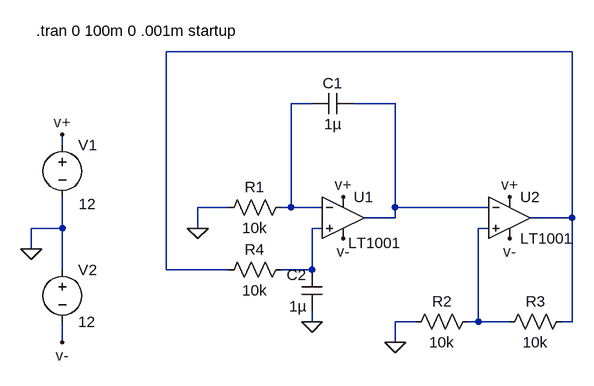
[diagram p0: schematic cuadrada_triangular3.asc]
cuadrada_triangular3.asc, the LTspice schematic file:
Version 4
SHEET 1 880 680
WIRE 528 -96 -96 -96
WIRE 128 -16 96 -16
WIRE 256 -16 192 -16
WIRE -256 48 -256 32
WIRE 0 144 -48 144
WIRE 96 144 96 -16
WIRE 96 144 80 144
WIRE 144 144 96 144
WIRE 256 144 256 -16
WIRE 400 144 256 144
WIRE 256 160 256 144
WIRE 256 160 208 160
WIRE 528 160 528 -96
WIRE 528 160 464 160
WIRE -256 176 -256 128
WIRE -256 176 -304 176
WIRE -48 176 -48 144
WIRE 144 176 128 176
WIRE 400 176 384 176
WIRE -304 208 -304 176
WIRE -256 240 -256 176
WIRE -96 240 -96 -96
WIRE 0 240 -96 240
WIRE 128 240 128 176
WIRE 128 240 80 240
WIRE 128 320 128 304
WIRE 288 320 256 320
WIRE 384 320 384 176
WIRE 384 320 368 320
WIRE 432 320 384 320
WIRE 528 320 528 160
WIRE 528 320 512 320
WIRE -256 352 -256 320
WIRE 256 352 256 320
FLAG -304 208 0
FLAG -256 32 v+
FLAG -256 352 v-
FLAG 256 352 0
FLAG -48 176 0
FLAG 128 320 0
FLAG 176 128 v+
FLAG 432 128 v+
FLAG 176 192 v-
FLAG 432 192 v-
SYMBOL Opamps\\LT1001 176 96 R0
WINDOW 3 8 103 Left 2
SYMATTR InstName U1
SYMBOL Opamps\\LT1001 432 96 R0
SYMATTR InstName U2
SYMBOL res 96 128 R90
WINDOW 0 0 56 VBottom 2
WINDOW 3 32 56 VTop 2
SYMATTR InstName R1
SYMATTR Value 10k
SYMBOL res 384 304 R90
WINDOW 0 0 56 VBottom 2
WINDOW 3 32 56 VTop 2
SYMATTR InstName R2
SYMATTR Value 10k
SYMBOL res 528 304 R90
WINDOW 0 0 56 VBottom 2
WINDOW 3 32 56 VTop 2
SYMATTR InstName R3
SYMATTR Value 10k
SYMBOL cap 192 -32 R90
WINDOW 0 0 32 VBottom 2
WINDOW 3 32 32 VTop 2
SYMATTR InstName C1
SYMATTR Value 1µ
SYMBOL voltage -256 32 R0
WINDOW 123 0 0 Left 2
WINDOW 39 0 0 Left 2
WINDOW 3 25 107 Left 2
SYMATTR Value 12
SYMATTR InstName V1
SYMBOL voltage -256 224 R0
WINDOW 123 0 0 Left 2
WINDOW 39 0 0 Left 2
SYMATTR InstName V2
SYMATTR Value 12
SYMBOL cap 144 304 R180
WINDOW 0 24 56 Left 2
WINDOW 3 24 8 Left 2
SYMATTR InstName C2
SYMATTR Value 1µ
SYMBOL res 96 224 R90
WINDOW 0 0 56 VBottom 2
WINDOW 3 32 56 VTop 2
SYMATTR InstName R4
SYMATTR Value 10k
TEXT -296 -128 Left 2 !.tran 0 100m 0 .001m startup

The netlist it stands for:
* cuadrada_triangular3.asc
XU1 N004 N002 v+ v- N003 LT1001  ; pins In+ In- V+ V- OUT
XU2 N005 N003 v+ v- N001 LT1001  ; pins In+ In- V+ V- OUT
R1 N002 0 10k
R2 N005 0 10k
R3 N001 N005 10k
C1 N003 N002 1µ
V1 v+ 0 12
V2 0 v- 12
C2 0 N004 1µ
R4 N004 N001 10k
.tran 0 100m 0 .001m startup
.lib LTC.lib
.backanno
.end